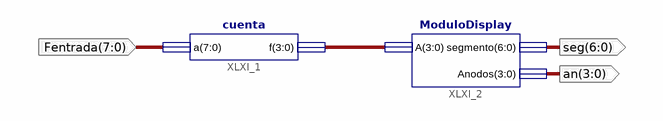
[diagram p0: schematic sheet 1]
// Xilinx ISE schematic superior.sch (spartan6) as structural Verilog: 2 symbols, 3 ports
module superior (
  input  [7:0] Fentrada,
  output [6:0] seg,
  output [3:0] an
);

  wire [3:0] XLXN_4;

  cuenta XLXI_1 (.a(Fentrada), .f(XLXN_4));
  ModuloDisplay XLXI_2 (.A(XLXN_4), .segmento(seg), .Anodos(an));
endmodule
